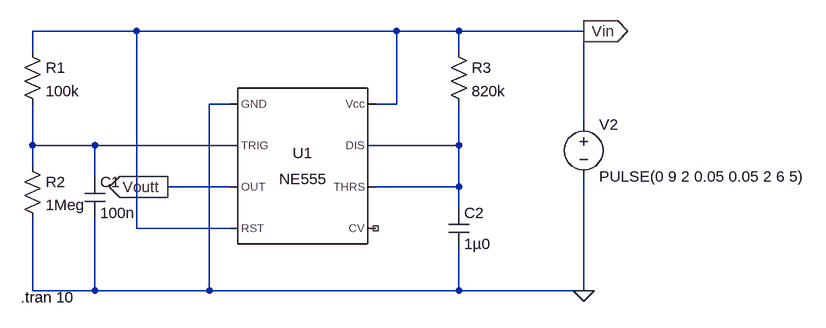
[diagram p0: schematic NE555_monostable.asc]
NE555_monostable.asc, the LTspice schematic file:
Version 4
SHEET 1 1216 680
WIRE -96 -48 -256 -48
WIRE 304 -48 -96 -48
WIRE 400 -48 304 -48
WIRE 592 -48 400 -48
WIRE -256 -16 -256 -48
WIRE 400 -16 400 -48
WIRE 48 64 16 64
WIRE 304 64 304 -48
WIRE 304 64 272 64
WIRE 592 96 592 -48
WIRE -256 128 -256 64
WIRE -160 128 -256 128
WIRE 48 128 -160 128
WIRE 400 128 400 64
WIRE 400 128 272 128
WIRE -256 160 -256 128
WIRE -160 176 -160 128
WIRE 48 192 -48 192
WIRE 400 192 400 128
WIRE 400 192 272 192
WIRE 400 224 400 192
WIRE -96 256 -96 -48
WIRE 48 256 -96 256
WIRE -256 352 -256 240
WIRE -160 352 -160 240
WIRE -160 352 -256 352
WIRE 16 352 16 64
WIRE 16 352 -160 352
WIRE 400 352 400 288
WIRE 400 352 16 352
WIRE 592 352 592 176
WIRE 592 352 400 352
FLAG 592 352 0
FLAG 592 -48 Vin
IOPIN 592 -48 Out
FLAG -48 192 Voutt
IOPIN -48 192 Out
SYMBOL Misc\\NE555 160 160 R0
SYMATTR InstName U1
SYMBOL res -272 -32 R0
SYMATTR InstName R1
SYMATTR Value 100k
SYMBOL res -272 144 R0
SYMATTR InstName R2
SYMATTR Value 1Meg
SYMBOL cap -176 176 R0
SYMATTR InstName C1
SYMATTR Value 100n
SYMBOL res 384 -32 R0
SYMATTR InstName R3
SYMATTR Value 820k
SYMBOL cap 384 224 R0
SYMATTR InstName C2
SYMATTR Value 1µ0
SYMBOL voltage 592 80 R0
WINDOW 123 0 0 Left 0
WINDOW 39 0 0 Left 0
SYMATTR InstName V2
SYMATTR Value PULSE(0 9 2 0.05 0.05 2 6 5)
TEXT -274 362 Left 2 !.tran 10

The netlist it stands for:
* NE555_monostable.asc
XU1 0 N001 Voutt Vin NC_01 N002 N002 Vin NE555  ; pins GND TRIG OUT RST CV THRS DIS Vcc
R1 Vin N001 100k
R2 N001 0 1Meg
C1 N001 0 100n
R3 Vin N002 820k
C2 N002 0 1µ0
V2 Vin 0 PULSE(0 9 2 0.05 0.05 2 6 5)
.tran 10
.lib NE555.sub
.backanno
.end